# EAGLE schematic tlacitka (EAGLE 9.5.1)
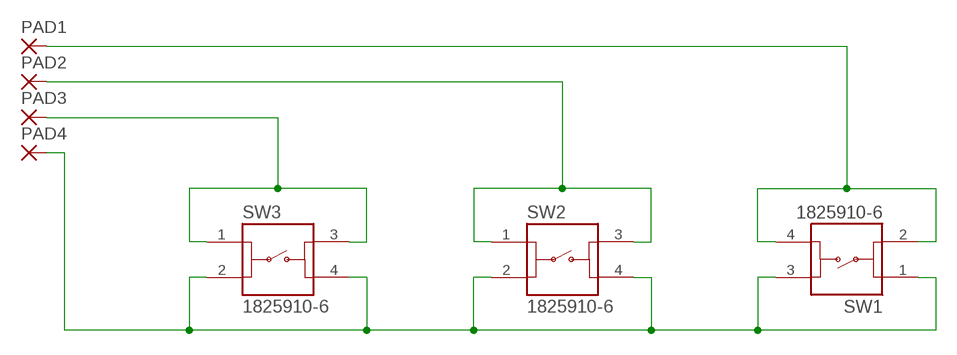
[diagram p0: schematic, sheet 1]

## Parts
PAD1  SMD5  [SMD2,54-5,08]
PAD2  SMD5  [SMD2,54-5,08]
PAD3  SMD5  [SMD2,54-5,08]
PAD4  SMD5  [SMD2,54-5,08]
SW1  1825910-6  [1825910-6]
SW2  1825910-6  [1825910-6]
SW3  1825910-6  [1825910-6]

## Nets
N$1: PAD4.1(P) SW1.1 SW1.3 SW2.2 SW2.4 SW3.2 SW3.4
N$2: PAD2.1(P) SW2.1 SW2.3
N$3: PAD1.1(P) SW1.2 SW1.4
N$4: PAD3.1(P) SW3.1 SW3.3

## Library data of the parts
PAD1-PAD4 = wirepad:SMD5: SMD PAD
SW1-SW3 = Switch:1825910-6: SWITCH TACTILE SPST-NO 0.05A 24V Manufacturer's datasheet <https://www.te.com/commerce/DocumentDelivery/DDEController?Action=srchrtrv&DocNm=1825910&DocType=Customer+Drawing&DocLang=English>; CREATED_BY: PCBLayout.com; DIGIKEY_PART_NUMBER: 450-1650-ND; MANUFACTURER: TE Connectivity ALCOSWITCH Switches; MPN: 1825910-6